# EAGLE design IRK (EAGLE 6.5.0)
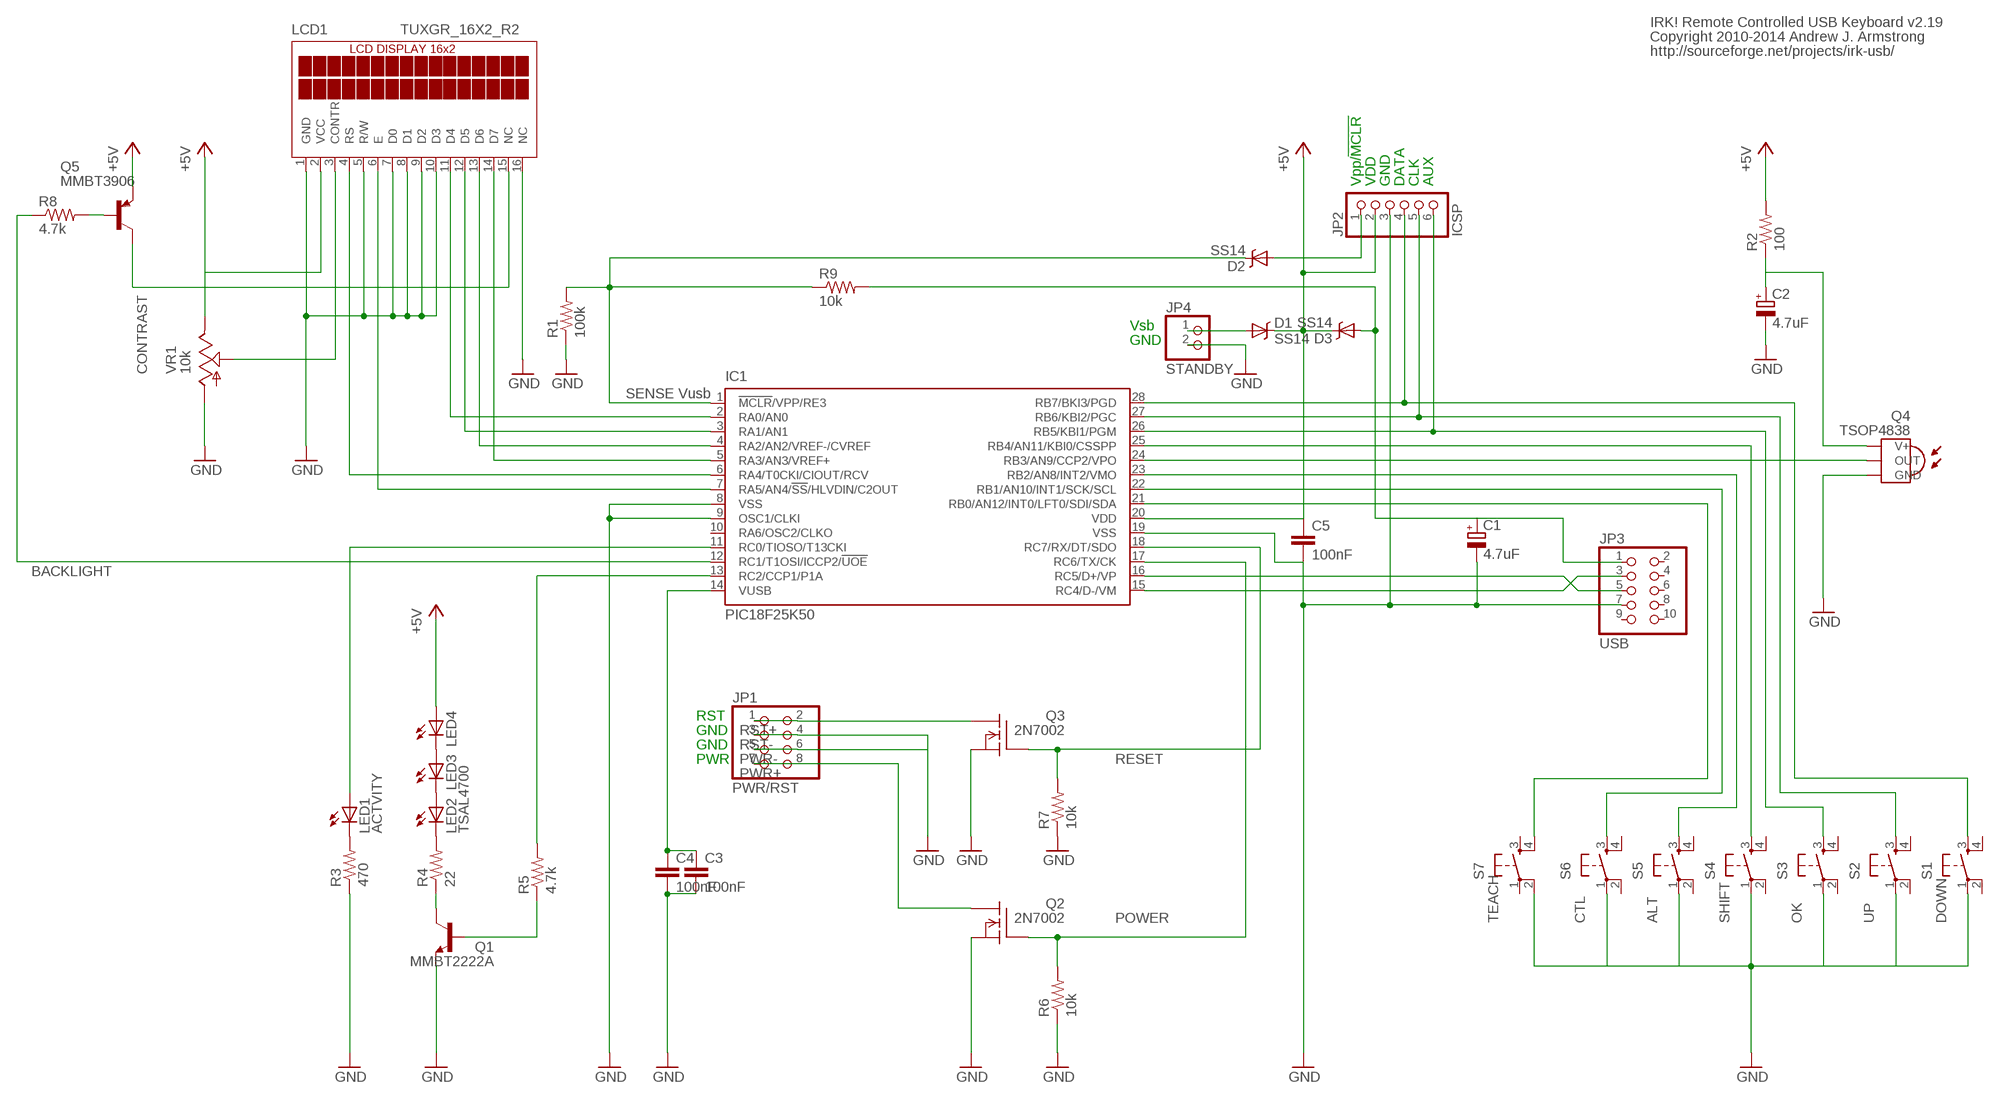
[diagram p0: schematic, sheet 1]

## Parts
C1  4.7uF  CPOL-EUSMCA  [SMC_A]
C2  4.7uF  CPOL-EUSMCA  [SMC_A]
C3  100nF  C-EUC0805  [C0805]
C4  100nF  C-EUC0805  [C0805]
C5  100nF  C-EUC0805  [C0805]
D1  SS14  DIODE-SCHOTTKY_  [SMA-DIODE]
D2  SS14  DIODE-SCHOTTKY_  [SMA-DIODE]
D3  SS14  DIODE-SCHOTTKY_  [SMA-DIODE]
IC1  PIC18F25K50  PIC18F2550_28W  [SO28W]
JP1  PWR/RST  PINHD-2X4  [2X04]
JP2  ICSP  PINHD-1X6  [1X06]
JP3  USB  PINHD-2X5  [2X05]
JP4  STANDBY  PINHD-1X2  [1X02]
LCD1  TUXGR_16X2_R2  [TUXGR_16X2_R2]
LED1  ACTVITY  LED5MM  [LED5MM]
LED2  TSAL4700  LED5MM  [LED5MM]
LED3  LED5MM  [LED5MM]
LED4  LED5MM  [LED5MM]
Q1  MMBT2222A  BC846A-NPN-SOT23-BEC  [SOT23-BEC]
Q2  2N7002  [SOT23]
Q3  2N7002  [SOT23]
Q4  TSOP4838  [TSOP18XX]
Q5  MMBT3906  MMBT3906LT1SMD  [SOT23-BEC]
R1  100k  R-US_M1206  [M1206]
R2  100  R-US_M1206  [M1206]
R3  470  R-US_M1206  [M1206]
R4  22  R-US_M1206  [M1206]
R5  4.7k  R-US_M1206  [M1206]
R6  10k  R-US_M1206  [M1206]
R7  10k  R-US_M1206  [M1206]
R8  4.7k  R-US_M1206  [M1206]
R9  10k  R-US_M1206  [M1206]
S1  DOWN  TAC_SWITCHSMD  [TACTILE_SWITCH_SMD]
S2  UP  TAC_SWITCHSMD  [TACTILE_SWITCH_SMD]
S3  OK  TAC_SWITCHSMD  [TACTILE_SWITCH_SMD]
S4  SHIFT  TAC_SWITCHSMD  [TACTILE_SWITCH_SMD]
S5  ALT  TAC_SWITCHSMD  [TACTILE_SWITCH_SMD]
S6  CTL  TAC_SWITCHSMD  [TACTILE_SWITCH_SMD]
S7  TEACH  TAC_SWITCHSMD  [TACTILE_SWITCH_SMD]
VR1  10k  TRIM_US-3223W  [3223W]

## Nets
+5V: C5.1 D1.C D3.C IC1.20(VDD) JP2.2 LCD1.2(VCC) LED4.A Q5.E R2.2 VR1.3(E)
GND: C1.- C2.- C3.2 C4.2 C5.2 IC1.8(VSS) IC1.9(OSC1/CLKI) IC1.19(VSS) JP1.3 JP1.4 JP1.5 JP1.6 JP2.3 JP3.7 JP4.2 LCD1.1(GND) LCD1.5(R/W) LCD1.7(D0) LCD1.8(D1) LCD1.9(D2) LCD1.10(D3) LCD1.16(NC) Q1.E Q2.2(S) Q3.2(S) Q4.GND R1.1 R3.1 R6.1 R7.1 S1.1 S2.1 S3.1 S4.1 S5.1 S6.1 S7.2 VR1.1(A)
N$1: IC1.2(RA0/AN0) LCD1.11(D4)
N$2: IC1.3(RA1/AN1) LCD1.12(D5)
N$3: IC1.4(RA2/AN2/VREF-/CVREF) LCD1.13(D6)
N$4: IC1.5(RA3/AN3/VREF+) LCD1.14(D7)
N$5: IC1.6(RA4/T0CKI/CIOUT/RCV) LCD1.4(RS)
N$6: IC1.7(RA5/AN4/!SS!/HLVDIN/C2OUT) LCD1.6(E)
N$7: LCD1.3(CONTR) VR1.2(S)
N$8: D2.C IC1.1(!MCLR!/VPP/RE3) R1.2 R9.1
N$9: IC1.18(RC7/RX/DT/SDO) Q3.1(G) R7.2
N$10: IC1.24(RB3/AN9/CCP2/VPO) Q4.OUT
N$11: JP1.1 JP1.2 Q3.3(D)
N$12: IC1.28(RB7/BKI3/PGD) JP2.4 S1.3
N$13: IC1.27(RB6/KBI2/PGC) JP2.5 S2.3
N$14: IC1.26(RB5/KBI1/PGM) JP2.6 S3.3
N$15: IC1.25(RB4/AN11/KBI0/CSSPP) S4.3
N$16: IC1.23(RB2/AN8/INT2/VMO) S5.3
N$17: IC1.22(RB1/AN10/INT1/SCK/SCL) S6.3
N$18: IC1.21(RB0/AN12/INT0/LFT0/SDI/SDA) S7.4
N$19: C3.1 C4.1 IC1.14(VUSB)
N$20: LED1.K(C) R3.2
N$21: C1.+ D3.A JP3.1 R9.2
N$22: JP1.7 JP1.8 Q2.3(D)
N$23: IC1.16(RC5/D+/VP) JP3.5
N$24: IC1.15(RC4/D-/VM) JP3.3
N$25: LED2.K(C) R4.2
N$26: LED2.A LED3.K(C)
N$27: LED3.A LED4.K(C)
N$28: IC1.13(RC2/CCP1/P1A) R5.2
N$29: Q1.B R5.1
N$30: Q1.C R4.1
N$31: LCD1.15(NC) Q5.C
N$32: D1.A JP4.1
N$34: IC1.12(RC1/T1OSI/ICCP2/!UOE) R8.1
N$36: Q5.B R8.2
N$37: IC1.17(RC6/TX/CK) Q2.1(G) R6.2
N$45: D2.A JP2.1
N$46: IC1.11(RC0/TIOSO/T13CKI) LED1.A
N$50: C2.+ Q4.VCC(V+) R2.1
Unconnected: IC1.10(RA6/OSC2/CLKO) JP3.2 JP3.4 JP3.6 JP3.8 JP3.9 JP3.10 S1.2 S1.4 S2.2 S2.4 S3.2 S3.4 S4.2 S4.4 S5.2 S5.4 S6.2 S6.4 S7.1 S7.3

## Notes on the sheet
- IRK! Remote Controlled USB Keyboard v2.19
- Copyright 2010-2014 Andrew J. Armstrong
- http://sourceforge.net/projects/irk-usb/
- Vpp/!MCLR | VDD | GND | DATA | CLK | AUX
- Vsb
- GND
- CONTRAST
- SENSE Vusb
- BACKLIGHT
- RST
- GND | RST+
- GND | RST-
- PWR | PWR- | RESET
- PWR+
- POWER

## Library data of the parts
C1 C2 = rcl:CPOL-EU: POLARIZED CAPACITOR, European symbol
C3-C5 = rcl:C-EU: CAPACITOR, European symbol
D1-D3 = SparkFun-DiscreteSemi:DIODE-SCHOTTKY: Commonly MBRA140.
IC1 = microchip:PIC18F2*_28: USB Microcontrollers with nanoWatt Technology High-Performance, Enhanced Flash, 28/40/44-Pin, Source: http://ww1.microchip.com/downloads/en/devicedoc/39632c.pdf; MF: MICROCHIP; MPN: PIC18F2550-I/SO; OC_FARNELL: 9321268; OC_NEWARK: 73K1297
JP1 = pinhead:PINHD-2X4: PIN HEADER
JP2 = pinhead:PINHD-1X6: PIN HEADER
JP3 = pinhead:PINHD-2X5: PIN HEADER
JP4 = pinhead:PINHD-1X2: PIN HEADER
LCD1 = offboard:TUXGR_16X2_R2: Tuxgraphics LCD display 16x2 characters reflective, without background light Source: tuxgr_12x2_r2.pdf; OC_FARNELL: unknown; OC_NEWARK: unknown
LED1-LED4 = led:LED: LED OSRAM: - CHIPLED LG R971, LG N971, LY N971, LG Q971, LY Q971, LO R971, LY R971 LH N974, LH R974 LS Q976, LO Q976, LY Q976 LO Q996 - Hyper CHIPLED LW Q18S LB Q993, LB Q99A, LB R99A - SideLED LS A670, LO A670, LY A670, LG A670, LP A670 LB A673, LV A673, LT A673, LW A673 LH A674 LY A675 LS A676, LA A676, LO A676, LY A676, LW A676 LS A679, LY A679, LG A679 - Hyper Micro SIDELED® LS Y876, LA Y876, LO Y876, LY Y876 LT Y87S - SmartLED LW L88C, LW L88S LB L89C, LB L89S, LG L890 LS L89K, LO L89K, LY L89K LS L896, LA L896, LO L896, LY L896 - TOPLED LS T670, LO T670, LY T670, LG T670, LP T670 LSG T670, LSP T670, LSY T670, LOP T670, LYG T670 LG T671, LOG T671, LSG T671 LB T673, LV T673, LT T673, LW T673 LH T674 LS T676, LA T676, LO T676, LY T676, LB T676, LH T676, LSB T676, LW T676 LB T67C, LV T67C, LT T67C, LS T67K, LO T67K, LY T67K, LW E67C LS E67B, LA E67B, LO E67B, LY E67B, LB E67C, LV E67C, LT E67C LW T67C LS T679, LY T679, LG T679 LS T770, LO T770, LY T770, LG T770, LP T770 LB T773, LV T773, LT T773, LW T773 LH T774 LS E675, LA E675, LY E675, LS T675 LS T776, LA T776, LO T776, LY T776, LB T776 LHGB T686 LT T68C, LB T68C - Hyper Mini TOPLED® LB M676 - Mini TOPLED Santana® LG M470 LS M47K, LO M47K, LY M47K Source: http://www.osram.convergy.de LUXEON: - LUMILED® LXK2-PW12-R00, LXK2-PW12-S00, LXK2-PW14-U00, LXK2-PW14-V00 LXK2-PM12-R00, LXK2-PM12-S00, LXK2-PM14-U00 LXK2-PE12-Q00, LXK2-PE12-R00, LXK2-PE12-S00, LXK2-PE14-T00, LXK2-PE14-U00 LXK2-PB12-K00, LXK2-PB12-L00, LXK2-PB12-M00, LXK2-PB14-N00, LXK2-PB14-P00, LXK2-PB14-Q00 LXK2-PR12-L00, LXK2-PR12-M00, LXK2-PR14-Q00, LXK2-PR14-R00 LXK2-PD12-Q00, LXK2-PD12-R00, LXK2-PD12-S00 LXK2-PH12-R00, LXK2-PH12-S00 LXK2-PL12-P00, LXK2-PL12-Q00, LXK2-PL12-R00 Source: www.luxeon.com KINGBRIGHT: KA-3528ASYC Source: www.kingbright.com
Q1 = transistor:*-NPN-: NPN Transistror BF959 corrected 2008.03.06
Q2 Q3 = transistors_gaui:2N7002
Q4 = tsop:TSOP4838: IR Receiver and Demodulator
Q5 = transistor-pnp:MMBT3906*: PNP Transistror
R1-R9 = rcl:R-US_: RESISTOR, American symbol
S1-S7 = SparkFun-Electromechanical:TAC_SWITCH: Momentary Switch Button commonly used for reset or general input. Spark Fun Electronics SKU : COM-00097 SMT- SWCH-08247; PROD_ID: SWCH-08247
VR1 = pot:TRIM_US-: POTENTIOMETER

## Board
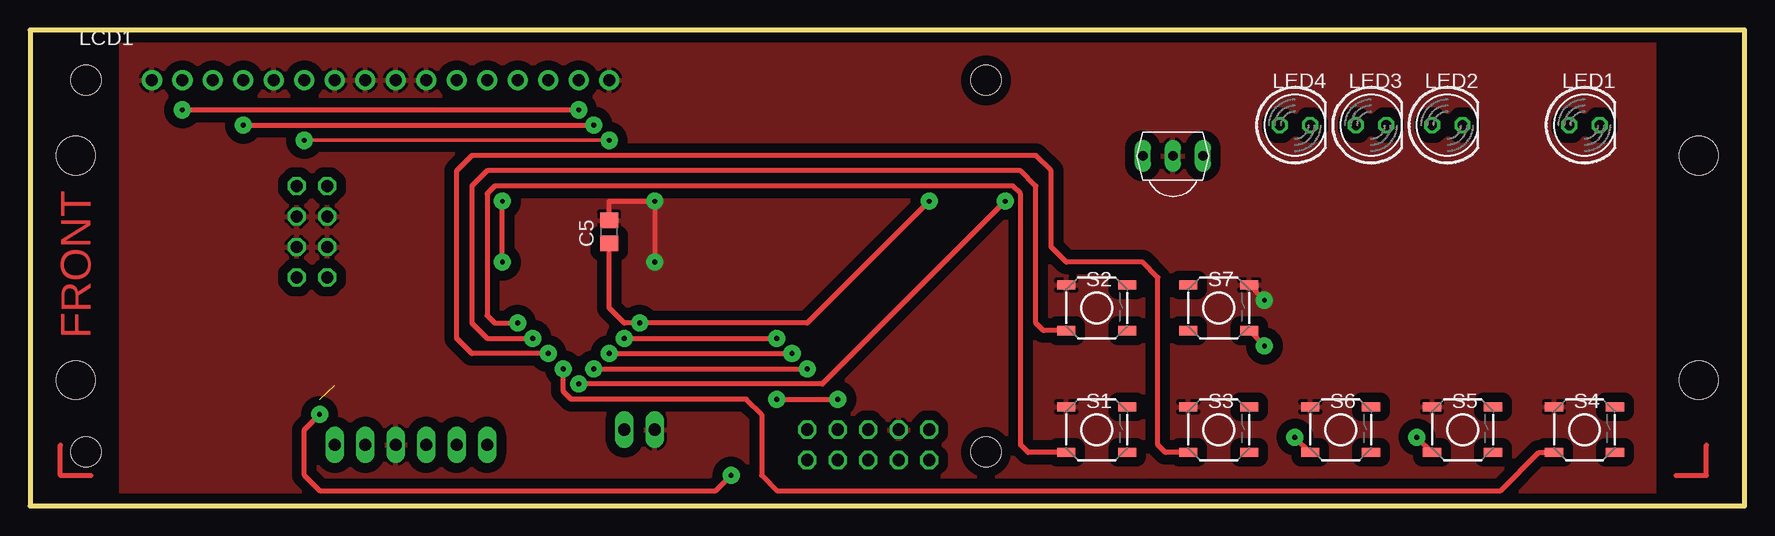
[diagram p1: board, top side]
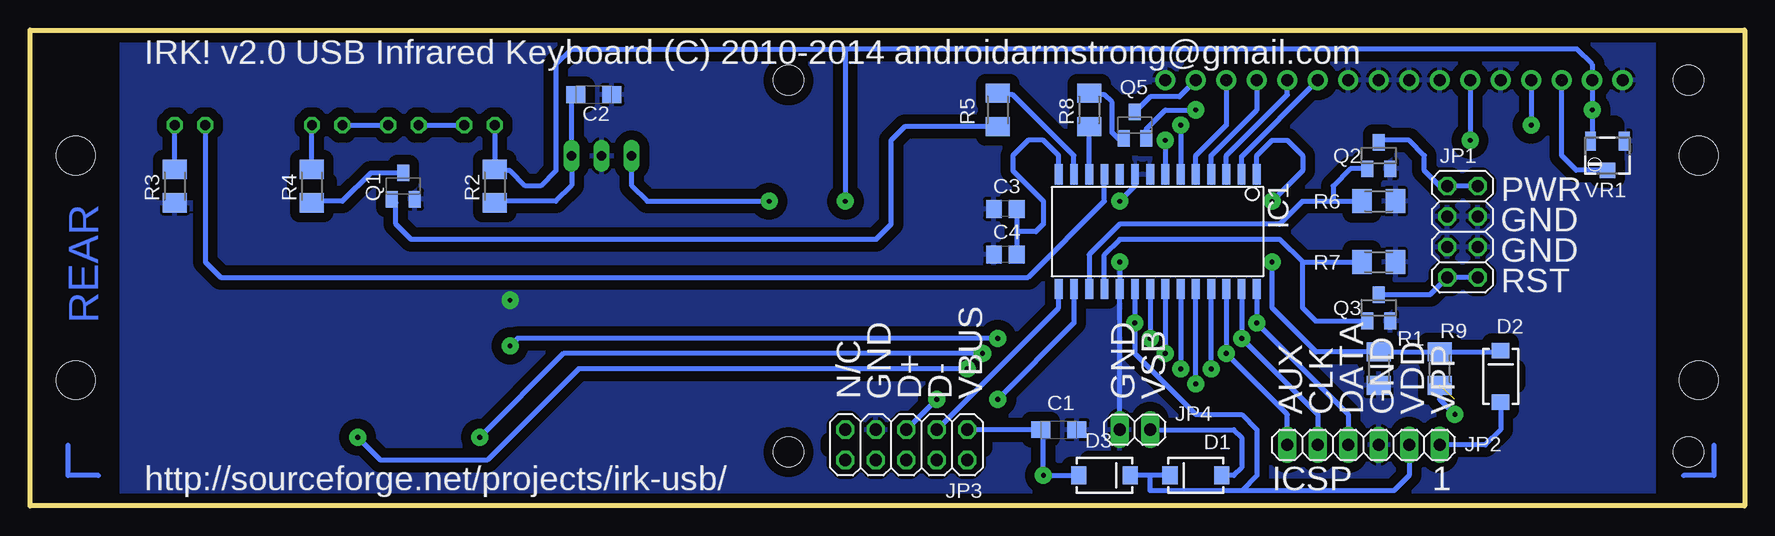
[diagram p2: board, bottom side, seen from below]

Size 142.88 x 39.69 mm. Coordinates in mm from the lower left corner, seen from the top.
Outline: 0,0 142.88,0 142.88,39.69 0,39.69 0,0
Copper layers (1*16): Top 0.035mm / dielectric 1.5mm / Bottom 0.035mm
Design rules "default *": minimum track width 12mil, minimum drill 16mil, track to track 8mil, track to pad 12mil, pad to pad 8mil, via to via 8mil, smd to smd 8mil, copper to edge 20mil, drill to drill 8mil, minimum pad ring 10mil, minimum via ring 20mil, stop-mask expansion 4mil, vias tented up to drill 0mil, thermal gap 10mil
Holes 3.2 mm at 3.81,29.21 3.81,10.48 139.06,29.21 139.06,10.48
bRestrict: area 118.1,26.3 to 120.6,27.1; area 129.5,26.3 to 132.1,27.1; area 63.5,4.8 to 76.2,5.3; area 102.9,26.3 to 105.4,27.1; area 40.6,24.1 to 51.4,26; area 40.6,19.7 to 50.8,21.6; area 19.1,10.2 to 21.6,11.4; area 52.1,1.3 to 54.6,3.8; area 10.8,29.2 to 12.1,31.8; area 44.5,2.5 to 47,3.8
vRestrict: area 86.4,3.8 to 91.4,8.9; area 86.4,14 to 91.4,19.1; area 96.5,14 to 101.6,19.1; area 96.5,3.8 to 101.6,8.9; area 106.7,3.8 to 111.8,8.9; area 116.8,3.8 to 121.9,8.9; area 127,3.8 to 132.1,8.9; area 40.6,19 to 57.1,26.7

### Footprints (pad centres in the part's own frame; a part is rotated, then mirrored left to right if it is on the bottom)
SMC_A = smd 1.6 x 1.4: + -1.5,0; - 1.5,0
C0805 = smd 1.3 x 1.5: 1 -0.95,0; 2 0.95,0
SMA-DIODE = smd 1.27 x 1.47: A -2.15,0; C 2.15,0
SO28W = smd 0.65 x 1.7: 1 -7.62,-4.78; 2 -6.35,-4.78; 3 -5.08,-4.78; 4 -3.81,-4.78; 5 -2.54,-4.78; 6 -1.27,-4.78; 7 0,-4.78; 8 1.27,-4.78; 9 2.54,-4.78; 10 3.81,-4.78; 11 5.08,-4.78; 12 6.35,-4.78; 13 7.62,-4.78; 14 8.89,-4.78; 15 8.89,4.78; 16 7.62,4.78; 17 6.35,4.78; 18 5.08,4.78; 19 3.81,4.78; 20 2.54,4.78; 21 1.27,4.78; 22 0,4.78; 23 -1.27,4.78; 24 -2.54,4.78; 25 -3.81,4.78; 26 -5.08,4.78; 27 -6.35,4.78; 28 -7.62,4.78
2X04 = drill 1.016 octagon: 1 -3.81,-1.27; 2 -3.81,1.27; 3 -1.27,-1.27; 4 -1.27,1.27; 5 1.27,-1.27; 6 1.27,1.27; 7 3.81,-1.27; 8 3.81,1.27
1X06 = drill 1.016 long: 1 -6.35,0; 2 -3.81,0; 3 -1.27,0; 4 1.27,0; 5 3.81,0; 6 6.35,0
2X05 = drill 1.016 octagon: 1 -5.08,-1.27; 2 -5.08,1.27; 3 -2.54,-1.27; 4 -2.54,1.27; 5 0,-1.27; 6 0,1.27; 7 2.54,-1.27; 8 2.54,1.27; 9 5.08,-1.27; 10 5.08,1.27
1X02 = drill 1.016 long: 1 -1.27,0; 2 1.27,0
TUXGR_16X2_R2 = drill 1 pad 1.676: 1 -32,15.5; 2 -29.46,15.5; 3 -26.92,15.5; 4 -24.38,15.5; 5 -21.84,15.5; 6 -19.3,15.5; 7 -16.76,15.5; 8 -14.22,15.5; 9 -11.68,15.5; 10 -9.14,15.5; 11 -6.6,15.5; 12 -4.06,15.5; 13 -1.52,15.5; 14 1.02,15.5; 15 3.56,15.5; 16 6.1,15.5 | hole 2.5: -37.5,-15.5; 37.5,-15.5; -37.5,15.5; 37.5,15.5
LED5MM = drill 0.813 octagon: A -1.27,0; K 1.27,0
SOT23-BEC = smd 1 x 1.4: B -0.95,-1.1; C 0,1.1; E 0.95,-1.1
SOT23 = smd 1 x 1.4: 1 -0.95,-1.1; 2 0.95,-1.1; 3 0,1.1
TSOP18XX = drill 0.813 long: GND -0.001,-0.027; OUT -2.501,-0.027; VCC 2.499,-0.027
M1206 = smd 1.6 x 2: 1 -1.4,0; 2 1.4,0
TACTILE_SWITCH_SMD = smd 1.524 x 0.762: 1 -2.54,1.905; 2 2.54,1.905; 3 -2.54,-1.905; 4 2.54,-1.905
3223W = smd 0.9 x 1.6: 1 -1.4,-1.215; 3 1.4,-1.215 | smd 1.3 x 1.3: 2 0,1.215

### Placement (x,y rotation side)
C1  57.15,6.35 0 bottom
C2  95.89,34.29 0 bottom
C3  61.59,24.77 180 bottom
C4  61.59,20.95 180 bottom
C5  48.26,22.86 90 top
D1  45.72,2.54 180 bottom
D2  20.32,10.79 90 bottom
D3  53.34,2.54 0 bottom
IC1  48.26,22.86 180 bottom
JP1  23.5,22.86 90 bottom
JP2  31.75,5.08 180 bottom
JP3  69.85,5.08 180 bottom
JP4  50.8,6.35 180 bottom
LCD1  42.16,19.99 0 top
LED1  129.54,31.75 0 top
LED2  118.11,31.75 0 top
LED3  111.76,31.75 0 top
LED4  105.41,31.75 0 top
Q1  111.76,26.67 0 bottom
Q2  30.48,29.21 0 bottom
Q3  30.48,16.51 0 bottom
Q4  95.25,29.21 0 top
Q5  50.8,31.75 0 bottom
R1  30.48,11.43 90 bottom
R2  104.14,26.67 90 bottom
R3  130.81,26.67 90 bottom
R4  119.38,26.67 90 bottom
R5  62.23,33.02 90 bottom
R6  30.48,25.4 180 bottom
R7  30.48,20.32 180 bottom
R8  54.61,33.02 90 bottom
R9  25.4,11.43 270 bottom
S1  88.9,6.35 0 top
S2  88.9,16.51 0 top
S3  99.06,6.35 0 top
S4  129.54,6.35 0 top
S5  119.38,6.35 0 top
S6  109.22,6.35 0 top
S7  99.06,16.51 0 top
VR1  11.43,29.21 180 bottom

### Tracks (layer width: path | path; a pad name or v marks a point on that pad's centre or on a via)
+5V  (via drill 0.41, 0.41 pad 0.81)
  Top 0.406: C5.1 48.26,16.51 49.53,15.24 v50.8,15.24 64.77,15.24 v74.93,25.4 | v45.72,33.02 v12.7,33.02
  Bottom 0.406: D1.C 49.53,2.54 | 49.53,2.54 D3.C 50.8,2.93 | 12.7,30.48 VR1.3 12.7,30.55 v12.7,33.02 LCD1.2 12.7,36.83 13.97,38.1 74.93,38.1 | IC1.20 v50.8,15.24 50.8,12.7 45.72,7.62 41.91,7.62 40.64,6.35 40.64,2.54 41.91,1.27 | 74.93,38.1 97.79,38.1 99.06,36.83 99.06,27.94 100.33,26.67 101.6,26.67 102.87,27.94 104.01,27.94 R2.2 LED4.A | 74.93,38.1 v74.93,25.4 | 41.91,1.27 49.53,1.27 49.53,2.54 | Q5.E 49.85,31.43 48.26,33.02 v45.72,33.02 | JP2.2 27.94,2.54 29.21,1.27 41.91,1.27
GND  (via drill 0.41)
  Top 0.406: C5.2 48.26,25.4 v52.07,25.4 v52.07,20.32 | S7.2 v102.87,17.14
  Bottom 0.406: v52.07,20.32 IC1.19 JP4.2 | 95.25,29.21 Q4.GND | v52.07,25.4 50.8,26.67 IC1.9
  pour Top (isolate 0.813): 7.62,0 135.35,0 135.35,39.52 7.62,39.52
  pour Bottom (isolate 0.813): 7.62,0 135.2,0.16 135.2,39.83 7.62,39.67
N$1
  Bottom 0.406: IC1.2 41.91,29.14 LCD1.11
N$2
  Bottom 0.406: IC1.3 43.18,29.21 38.1,34.29 LCD1.12
N$3
  Bottom 0.406: IC1.4 44.45,29.21 40.64,33.02 LCD1.13
N$4  (1 unrouted)
  Bottom 0.406: IC1.5 45.72,29.21 43.18,31.75 LCD1.14
N$5  (via drill 0.41)
  Top 0.406: v17.78,31.75 v46.99,31.75
  Bottom 0.406: v46.99,31.75 IC1.6 | LCD1.4 v17.78,31.75
N$6  (via drill 0.41)
  Top 0.305: v22.86,30.48 v48.26,30.48
  Bottom 0.406: v48.26,30.48 IC1.7 | LCD1.6 v22.86,30.48
N$7  (1 unrouted)
  Bottom 0.406: VR1.2 14.03,28 15.24,29.21 LCD1.3
N$8  (via drill 0.41)
  Top 0.406: v39.37,20.32 v39.37,25.4
  Bottom 0.406: 20.32,12.7 D2.C 20.32,12.83 R9.1 R1.2 35.69,12.83 39.37,16.51 v39.37,20.32 | IC1.1 40.64,29.21 39.37,30.48 38.1,30.48 36.83,29.21 36.83,27.94 v39.37,25.4
N$9
  Bottom 0.406: IC1.18 53.34,20.95 52.07,22.23 38.73,22.23 36.83,20.32 | 36.83,20.32 36.83,16.51 35.73,15.41 Q3.1 | 36.83,20.32 R7.2
N$10  (via drill 0.41)
  Top 0.406: v45.72,10.16 66.04,10.16 v81.28,25.4
  Bottom 0.406: v45.72,10.16 IC1.24 | v81.28,25.4 91.44,25.4 92.71,26.67 Q4.OUT
N$11
  Bottom 0.406: JP1.1 JP1.2 26.2,17.61 Q3.3
N$12  (via drill 0.41)
  Top 0.406: S1.3 83.19,4.45 82.55,5.08 82.55,26.04 81.92,26.67 38.73,26.67 38.1,26.04 38.1,15.88 38.73,15.24 v40.64,15.24
  Bottom 0.406: JP2.4 33.02,7.62 v40.64,15.24 IC1.28
N$13  (via drill 0.41)
  Top 0.406: S2.3 84.45,14.61 83.82,15.24 83.82,26.67 82.55,27.94 38.1,27.94 36.83,26.67 36.83,15.24 38.1,13.97 v41.91,13.97
  Bottom 0.406: IC1.27 v41.91,13.97 35.56,7.62 JP2.5
N$14  (via drill 0.41)
  Top 0.406: S3.3 94.61,4.45 93.98,5.08 93.98,19.05 92.71,20.32 86.36,20.32 85.09,21.59 85.09,27.94 83.82,29.21 36.83,29.21 35.56,27.94 35.56,13.97 36.83,12.7 v43.18,12.7
  Bottom 0.406: JP2.6 38.1,7.62 v43.18,12.7 IC1.26
N$15  (via drill 0.41)
  Top 0.406: v44.45,11.43 44.45,9.53 45.09,8.89 59.69,8.89 60.96,7.62 60.96,2.54 62.23,1.27 122.56,1.27 125.73,4.45 S4.3
  Bottom 0.406: v44.45,11.43 IC1.25
N$16  (via drill 0.41)
  Top 0.406: v115.57,5.71 S5.3 | v46.99,11.43 v64.77,11.43
  Bottom 0.406: v115.57,5.71 113.67,3.81 104.78,3.81 97.16,11.43 v64.77,11.43 | IC1.23 v46.99,11.43
N$17  (via drill 0.41)
  Top 0.406: v105.41,5.71 S6.3 | v48.26,12.7 v63.5,12.7
  Bottom 0.406: v105.41,5.71 98.42,12.7 v63.5,12.7 | IC1.22 v48.26,12.7
N$18  (via drill 0.41)
  Top 0.406: v49.53,13.97 v62.23,13.97 | S7.4 v102.87,13.34
  Bottom 0.406: v62.23,13.97 102.23,13.97 v102.87,13.34 | IC1.21 v49.53,13.97
N$19
  Bottom 0.406: C3.1 60.65,22.86 | 60.65,22.86 C4.1 | IC1.14 57.15,29.21 58.42,30.48 59.69,30.48 60.96,29.21 60.96,27.94 58.42,25.4 58.42,23.5 59.05,22.86 60.65,22.86
N$20
  Bottom 0.406: R3.2 LED1.K
N$21  (via drill 0.41)  (1 unrouted)
  Top 0.406: v24.13,7.62 22.86,6.35 22.86,2.54 24.13,1.27 57.15,1.27 v58.42,2.54
  Bottom 0.406: C1.+ JP3.1 | 58.42,6.35 C1.+ | C1.+ 58.42,6.12 v58.42,2.54 D3.A | R9.2 25.4,8.89 v24.13,7.62
N$22
  Bottom 0.406: JP1.7 JP1.8 25.4,26.67 26.67,27.94 26.67,29.21 27.94,30.48 30.31,30.48 Q2.3
N$23  (via drill 0.41)
  Top 0.406: v62.23,8.89 v67.31,8.89
  Bottom 0.406: IC1.16 55.88,15.24 v62.23,8.89 | v67.31,8.89 JP3.5
N$24
  Bottom 0.406: JP3.3 57.15,16.51 IC1.15
N$25
  Bottom 0.406: R4.2 LED2.K
N$26
  Bottom 0.406: LED2.A LED3.K
N$27
  Bottom 0.406: LED3.A LED4.K
N$28
  Bottom 0.406: IC1.13 55.88,29.21 60.96,34.29 62.1,34.29 R5.2
N$29
  Bottom 0.406: Q1.B 112.39,25.25 112.39,23.5 111.12,22.23 72.39,22.23 71.12,23.5 71.12,30.48 69.98,31.62 R5.1
N$30
  Bottom 0.406: Q1.C 114.47,27.77 116.84,25.4 119.25,25.4 R4.1
N$31
  Bottom 0.406: Q5.C 49.53,34.12 47.09,34.12 LCD1.15
N$32
  Bottom 0.406: JP4.1 42.55,6.35 41.91,5.71 41.91,3.17 42.55,2.54 D1.A
N$34
  Bottom 0.406: IC1.12 R8.1
N$36
  Bottom 0.406: Q5.B 52.24,30.65 52.7,31.11 52.7,33.66 53.34,34.29 54.48,34.29 R8.2
N$37
  Bottom 0.406: IC1.17 54.61,20.95 52.07,23.5 38.73,23.5 36.83,25.4 34.29,25.4 | 34.29,25.4 R6.2 | Q2.1 32.85,28.11 34.29,26.67 34.29,25.4
N$41
  Top 0.406: 2.54,5.08 2.54,2.54 5.08,2.54
N$42
  Top 0.406: 137.16,2.54 139.7,2.54 139.7,5.08
N$43
  Bottom 0.406: 2.54,5.08 2.54,2.54 5.08,2.54
N$44
  Bottom 0.406: 137.16,2.54 139.7,2.54 139.7,5.08
N$45
  Bottom 0.406: D2.A 20.32,6.35 21.59,5.08 JP2.1
N$46
  Bottom 0.406: IC1.11 53.34,25.4 59.69,19.05 127,19.05 128.27,20.32 LED1.A
N$50
  Bottom 0.406: C2.+ 97.79,34.29 97.75,34.25 Q4.VCC 97.75,26.71 99.06,25.4 104.01,25.4 R2.1

### Text on the board
Top: FRONT
Bottom: REAR
_tsilk: IR RX | IR TX | UP | TEACH | DOWN | OK | CTL | ALT | ALT | SHIFT
_bsilk: IRK! v2.0 USB Infrared Keyboard (C) 2010-2014 androidarmstrong@gmail.com | PWR | GND | GND | RST | VSB | GND | VBUS | D- | D+ | GND | N/C | VPP | VDD | GND | DATA | CLK | AUX | 1 | ICSP | http://sourceforge.net/projects/irk-usb/